# Altium project joystickDisplay.PrjPcb
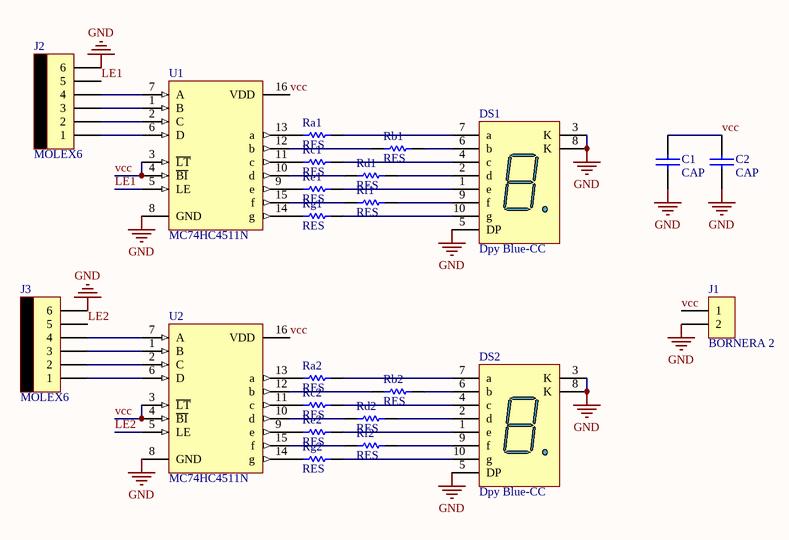
[diagram p0: joystickDisplay.SchDoc]
1 sheet, 23 parts. Net scope: global (net labels, ports and power ports of the same name join across sheets).
Board file: joystickDisplay.PcbDoc

## Sheet joystickDisplay.SchDoc
size A4

### Parts
C1  CAP  [CAP200]
C2  CAP  [CAP200]
DS1  Dpy Blue-CC  [H]
DS2  Dpy Blue-CC  [H]
J1  BORNERA 2  [BORNERA2]
J2  MOLEX6  [MOLEX6]
J3  MOLEX6  [MOLEX6]
Ra1  RES  [RES400]
Ra2  RES  [RES400]
Rb1  RES  [RES400]
Rb2  RES  [RES400]
Rc1  RES  [RES400]
Rc2  RES  [RES400]
Rd1  RES  [RES400]
Rd2  RES  [RES400]
Re1  RES  [RES400]
Re2  RES  [RES400]
Rf1  RES  [RES400]
Rf2  RES  [RES400]
Rg1  RES  [RES400]
Rg2  RES  [RES400]
U1  MC74HC4511N  [648-08]
U2  MC74HC4511N  [648-08]

### Nets
GND: C1.2 C2.2 DS1.3(K) DS1.5(DP) DS1.8(K) DS2.3(K) DS2.5(DP) DS2.8(K) J1.2 J2.6 J3.6 U1.8(GND) U2.8(GND)
LE1: J2.5 U1.5(LE)
LE2: J3.5 U2.5(LE)
vcc: C1.1 C2.1 J1.1 U1.3(~{LT}) U1.4(~{BI}) U1.16(VDD) U2.3(~{LT}) U2.4(~{BI}) U2.16(VDD)
NetDS1_1: DS1.1(e) Re1.2
NetDS1_2: DS1.2(d) Rd1.2
NetDS1_4: DS1.4(c) Rc1.2
NetDS1_6: DS1.6(b) Rb1.2
NetDS1_7: DS1.7(a) Ra1.2
NetDS1_9: DS1.9(f) Rf1.2
NetDS1_10: DS1.10(g) Rg1.2
NetDS2_1: DS2.1(e) Re2.2
NetDS2_2: DS2.2(d) Rd2.2
NetDS2_4: DS2.4(c) Rc2.2
NetDS2_6: DS2.6(b) Rb2.2
NetDS2_7: DS2.7(a) Ra2.2
NetDS2_9: DS2.9(f) Rf2.2
NetDS2_10: DS2.10(g) Rg2.2
NetJ2_1: J2.1 U1.6(D)
NetJ2_2: J2.2 U1.2(C)
NetJ2_3: J2.3 U1.1(B)
NetJ2_4: J2.4 U1.7(A)
NetJ3_1: J3.1 U2.6(D)
NetJ3_2: J3.2 U2.2(C)
NetJ3_3: J3.3 U2.1(B)
NetJ3_4: J3.4 U2.7(A)
NetRa1_1: Ra1.1 U1.13(a)
NetRa2_1: Ra2.1 U2.13(a)
NetRb1_1: Rb1.1 U1.12(b)
NetRb2_1: Rb2.1 U2.12(b)
NetRc1_1: Rc1.1 U1.11(c)
NetRc2_1: Rc2.1 U2.11(c)
NetRd1_1: Rd1.1 U1.10(d)
NetRd2_1: Rd2.1 U2.10(d)
NetRe1_1: Re1.1 U1.9(e)
NetRe2_1: Re2.1 U2.9(e)
NetRf1_1: Rf1.1 U1.15(f)
NetRf2_1: Rf2.1 U2.15(f)
NetRg1_1: Rg1.1 U1.14(g)
NetRg2_1: Rg2.1 U2.14(g)

### Library data of the parts
DS1 DS2 = Dpy Blue-CC: 14.2 mm General Purpose Blue 7-Segment Display: CC, RH DP, Gray Surface; MinimumIntensity: 2020 ucd; Note: IF = 10 mA; Published: 8-Jun-2000; LatestRevisionDate: 17-Dec-2003; LatestRevisionNote: Schematic revised, PCB Footprint replaced.; DatasheetVersion: 24-Sep-2002; PackageVersion: 24-Sep-2002; PackageReference: H; Publisher: Altium Limited; PackageDescription: LED, 7-Segment Display, 14.2 mm, RHD; 10 Leads; Row Space 15.24 mm; Pitch 2.54 mm; Colour: Blue; ComponentLink1Description: Manufacturer Link; ComponentLink1URL: http://www.agilent.com/
U1 U2 = MC74HC4511N: BCD-to-Seven-Segment Latch/Decoder/Display Driver; Published: 17-Jul-2002; LatestRevisionDate: 06-Jun-2005; LatestRevisionNote: Stylized 3D Model Added.; DatasheetVersion: 1989; PackageReference: 648-08; Publisher: Altium Limited; PackageDescription: DIP; 16 Leads; Row Spacing 7.62 mm; Pitch 2.54 mm; Code_JEDEC: MS-001-BB; ComponentLink1Description: Manufacturer Link; ComponentLink1URL: http://www.onsemi.com/site/products/parametrics/0,4446,197,00.html